# Altium schematic sheet osd.SchDoc
size A4
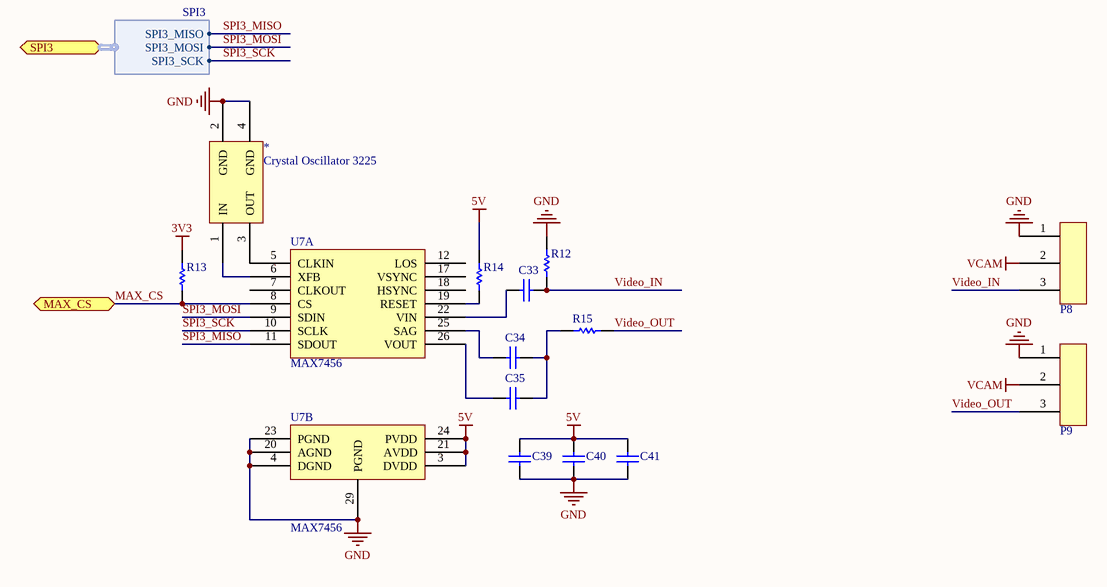
[diagram p0: osd.SchDoc]

## Parts
*  Crystal Oscillator 3225  [TSX-3225]
C33  CAP 100nF 25V 0603(1608)  [CAPC0603(1608)100_N]  (value not drawn)
C34  CAP 47uF 16V 1206(3216)  [CAPC1206(3216)190_M]  (value not drawn)
C35  CAP 47uF 16V 1206(3216)  [CAPC1206(3216)190_M]  (value not drawn)
C39  CAP 100nF 35V 0402(1005)  [CAPC0402(1005)60_L]  (value not drawn)
C40  CAP 100nF 35V 0402(1005)  [CAPC0402(1005)60_L]  (value not drawn)
C41  CAP 100nF 35V 0402(1005)  [CAPC0402(1005)60_L]  (value not drawn)
P8  3 Pads  [3Pads]  (value not drawn)
P9  3 Pads  [3Pads]  (value not drawn)
R12  75R 5% 0603(1608)  [RESC0603(1608)_N]  (value not drawn)
R13  10K 5% 0402(1005)  [RESC0402(1005)_N]  (value not drawn)
R14  10K 5% 0402(1005)  [RESC0402(1005)_L]  (value not drawn)
R15  75R 5% 0402(1005)  [RESC0402(1005)_L]  (value not drawn)
U7  MAX7456  [SOP28]  (parts A,B of 2)

## Ports
MAX_CS, SPI3 (harness SPI3)

## Harnesses
SPI3: SPI3_MISO, SPI3_MOSI, SPI3_SCK

## Nets
3V3: R13.2
5V: C39.2 C40.2 C41.2 R14.2 U7.3(DVDD) U7.21(AVDD) U7.24(PVDD)
GND: *.2(GND) *.4(GND) C39.1 C40.1 C41.1 P8.1 P9.1 R12.2 U7.4(DGND) U7.20(AGND) U7.23(PGND) U7.29(PGND)
VCAM: P8.2 P9.2
MAX_CS: R13.1 U7.8(CS) ; port MAX_CS
SPI3_MISO: U7.11(SDOUT) ; port SPI3.SPI3_MISO
SPI3_MOSI: U7.9(SDIN) ; port SPI3.SPI3_MOSI
SPI3_SCK: U7.10(SCLK) ; port SPI3.SPI3_SCK
Video_IN: C33.2 P8.3 R12.1
Video_OUT: P9.3 R15.2
Net*_1: *.1(IN) U7.6(XFB)
Net*_3: *.3(OUT) U7.5(CLKIN)
NetC33_1: C33.1 U7.22(VIN)
NetC34_1: C34.1 U7.25(SAG)
NetC34_2: C34.2 C35.2 R15.1
NetC35_1: C35.1 U7.26(VOUT)
NetR14_1: R14.1 U7.19(RESET)

Not connected (* = marked no-connect by the designer): U7 7(CLKOUT) 12(LOS) 17(VSYNC) 18(HSYNC)

## Library data of the parts
* = TSX-3225
C33 = CMP-1035-02589-1: CAP 100nF 25V ±20% 0603 (1608 Metric) Thickness 1mm SMD; Case-EIA: 0603; Tolerance: Â±20%; Case-Metric: 1608; Value: 100nF; Max Thickness: 1 mm; Technology: SMT; Rated Voltage: 25 V
C34 C35 = CMP-1037-05003-1: CAP 47uF 16V ±20% 1206 (3216 Metric) Thickness 1.9mm SMD; Tolerance: Â±20%; Case-EIA: 1206; Case-Metric: 3216; Value: 47uF; Max Thickness: 1.9 mm; Rated Voltage: 16 V; Technology: SMT
C39-C41 = CMP-1034-02075-1: CAP 100nF 35V ±10% 0402 (1005 Metric) Thickness 0.6mm SMD; Case-Metric: 1005; Case-EIA: 0402; Tolerance: Â±10%; Max Thickness: 0.6 mm; Value: 100nF; Technology: SMT; Rated Voltage: 35 V
R12 = CMP-1012-00047-1: 75R 0.1W 5% 0603 (1608 Metric)  SMD; Case-EIA: 0603; Value: 75.00 Ohm; Case-Metric: 1608; Technology: SMT; Tolerance: 5 %; Power: 0.1 W
R13 R14 = CMP-1011-00098-1: 10K 0.063W 5% 0402 (1005 Metric)  SMD; Case-Metric: 1005; Value: 10000.00 Ohm; Case-EIA: 0402; Technology: SMT; Tolerance: 5 %; Power: 0.063 W
R15 = CMP-1011-00047-1: 75R 0.063W 5% 0402 (1005 Metric)  SMD; Value: 75.00 Ohm; Case-Metric: 1005; Case-EIA: 0402; Power: 0.063 W; Tolerance: 5 %; Technology: SMT